# Altium schematic sheet Sheet1.SchDoc
size A; SheetNumber: 1; SheetTotal: 1
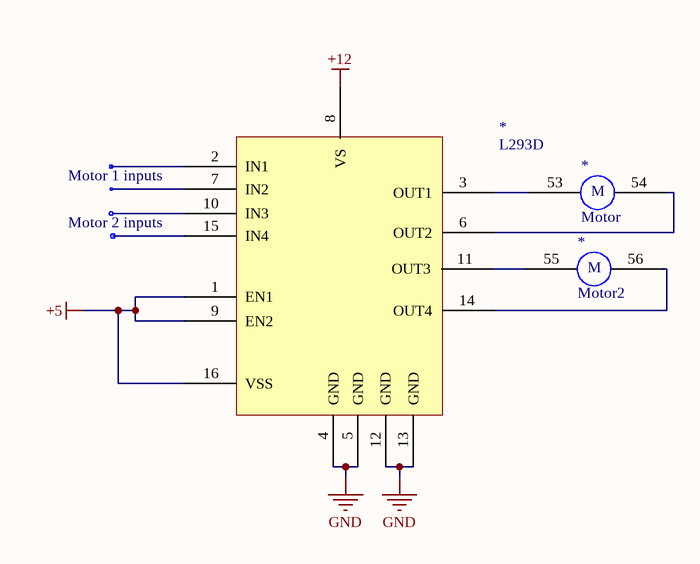
[diagram p0: Sheet1.SchDoc]

## Parts
(Parts that share a designator on the sheet are numbered #1, #2 ... from top to bottom, then left to right.)
*#1  Motor  [Motor]
*#2  L293D  [L293D]
*#3  Motor2  [Motor]

## Nets
+5: *#2.1(EN1) *#2.9(EN2) *#2.16(VSS)
+12: *#2.8(VS)
GND: *#2.4(GND) *#2.5(GND) *#2.12(GND) *#2.13(GND)
Net*#1_53: *#1.53 *#2.3(OUT1)
Net*#1_54: *#1.54 *#2.6(OUT2)
Net*#2_11: *#2.11(OUT3) *#3.55
Net*#2_14: *#2.14(OUT4) *#3.56

Not connected (* = marked no-connect by the designer): *#2 2(IN1) 7(IN2) 10(IN3) 15(IN4)

## Notes on the sheet
- (near *#2) Motor 1 inputs
- (near *#2) Motor 2 inputs
- (in symbol Motor) M
- (in symbol Motor2) M